# Altium schematic sheet S08.SchDoc: Quad Linear Amplifier
size 381 x 254 mm; Revision: 1.6; SheetNumber: 8; SheetTotal: 9
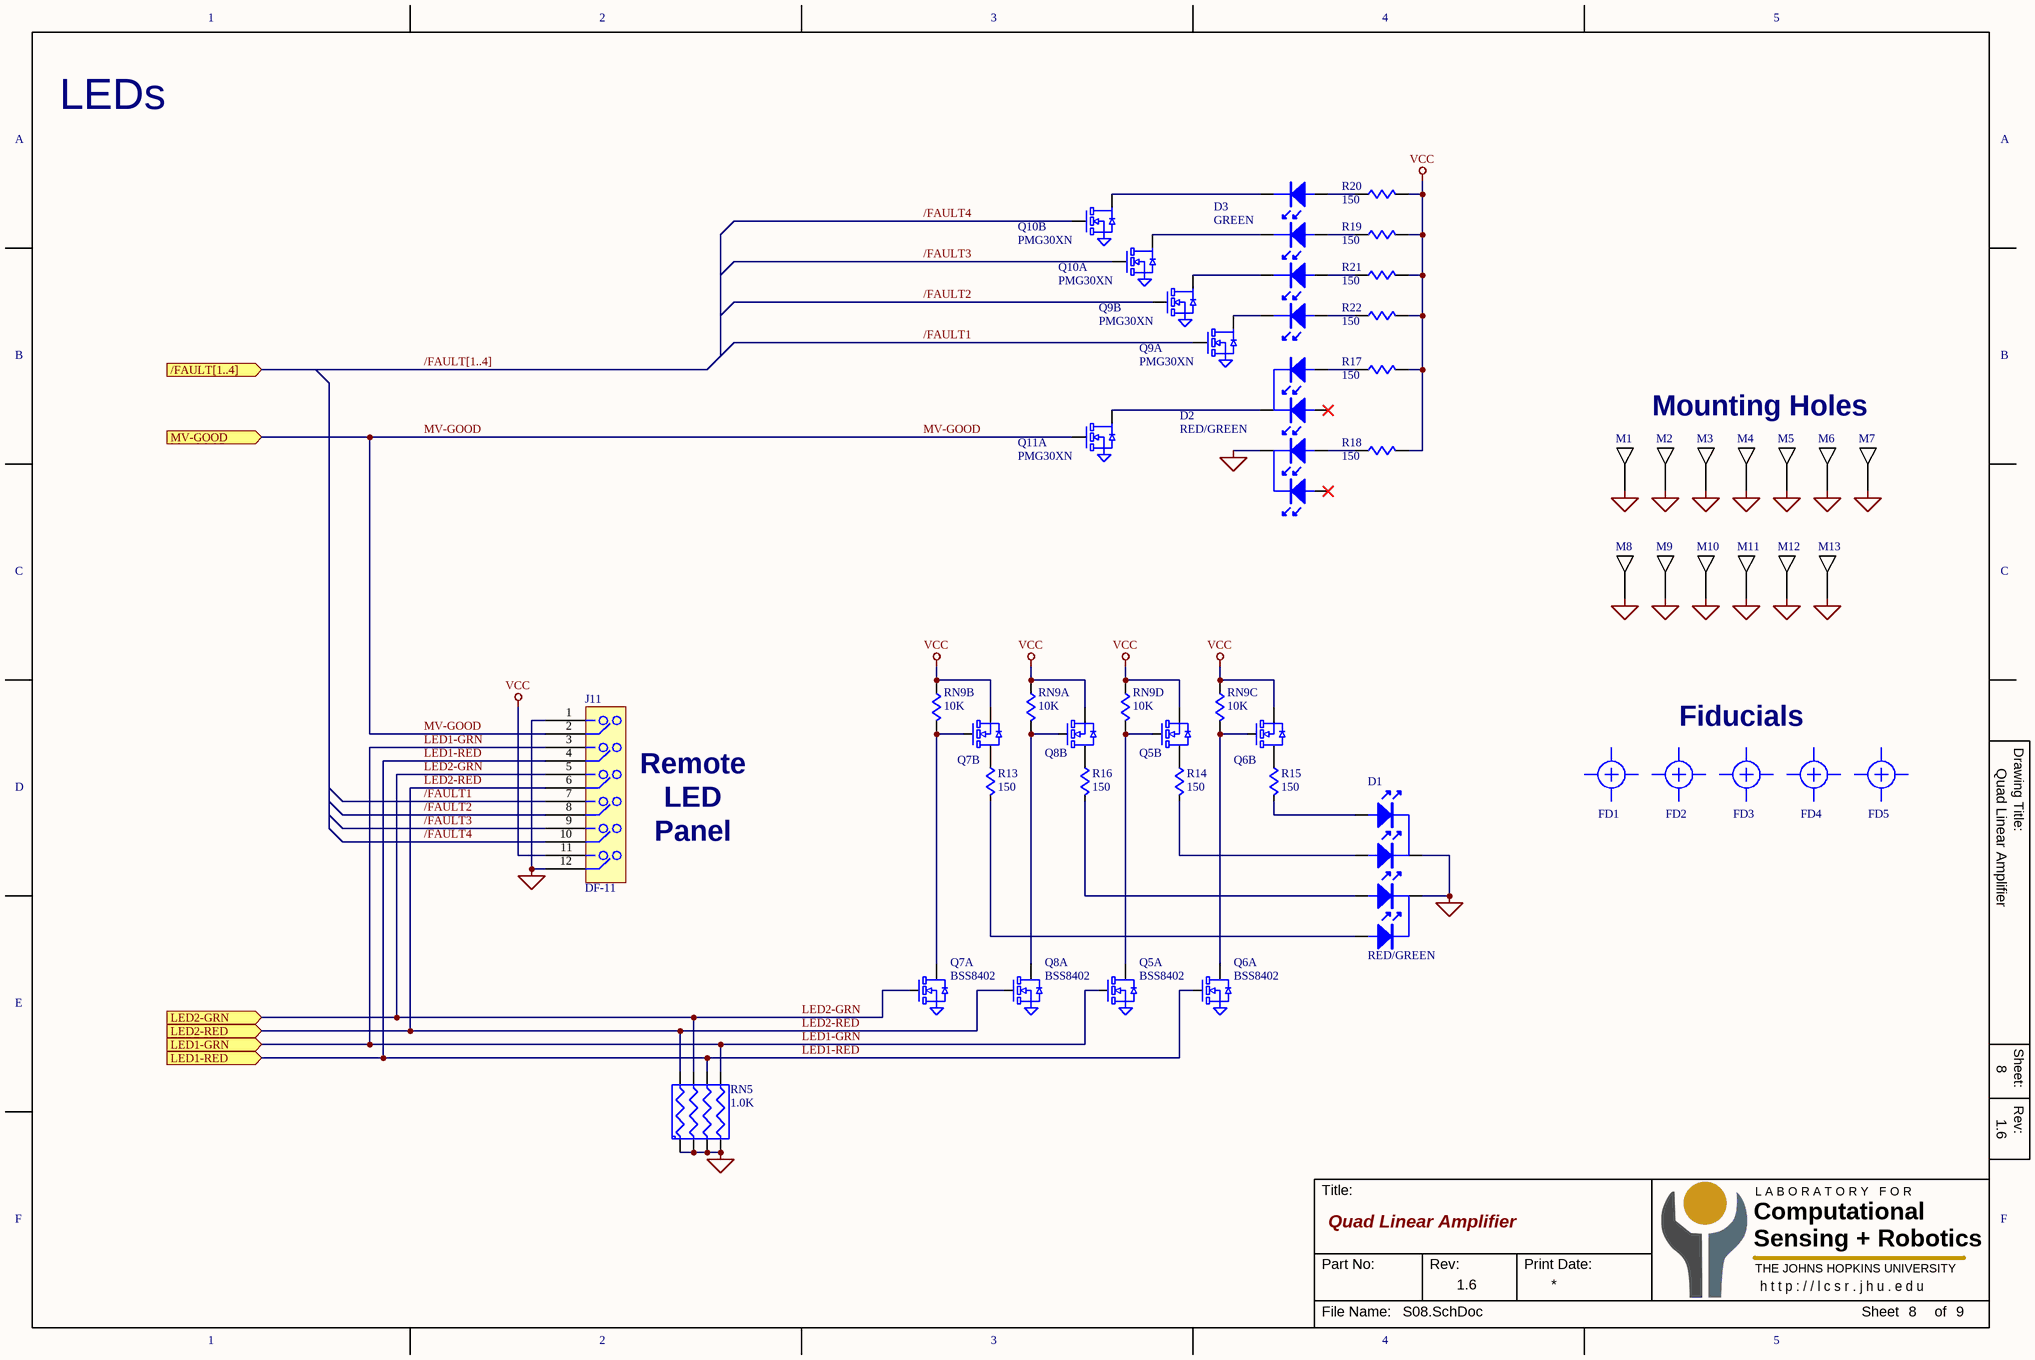
[diagram p0: S08.SchDoc]

## Parts
D1  RED/GREEN  [LED-3MM-2C-DUAL]
D2  RED/GREEN  [LED-3MM-2C-DUAL]
D3  GREEN  [LED-3MM-QUAD]
FD1  FD  [FD]  (value not drawn)  (no BOM)
FD2  FD  [FD]  (value not drawn)  (no BOM)
FD3  FD  [FD]  (value not drawn)  (no BOM)
FD4  FD  [FD]  (value not drawn)  (no BOM)
FD5  FD  [FD]  (value not drawn)  (no BOM)
J11  DF-11  [HDR-6x2-2MM]
M1  MHOLE  [MHOLE4]  (value not drawn)  (no BOM)
M2  MHOLE  [MHOLE4]  (value not drawn)  (no BOM)
M3  MHOLE  [MHOLE4]  (value not drawn)  (no BOM)
M4  MHOLE  [MHOLE4]  (value not drawn)  (no BOM)
M5  MHOLE  [MHOLE4]  (value not drawn)  (no BOM)
M6  MHOLE  [MHOLE4]  (value not drawn)  (no BOM)
M7  MHOLE  [MHOLE4]  (value not drawn)  (no BOM)
M8  MHOLE  [MHOLE4]  (value not drawn)  (no BOM)
M9  MHOLE  [MHOLE4]  (value not drawn)  (no BOM)
M10  MHOLE  [MHOLE4]  (value not drawn)  (no BOM)
M11  MHOLE  [MHOLE4]  (value not drawn)  (no BOM)
M12  MHOLE  [MHOLE4]  (value not drawn)  (no BOM)
M13  MHOLE  [MHOLE4]  (value not drawn)  (no BOM)
Q5  BSS8402  [SC70-6]  (parts A,B of 2)
Q6  BSS8402  [SC70-6]  (parts A,B of 2)
Q7  BSS8402  [SC70-6]  (parts A,B of 2)
Q8  BSS8402  [SC70-6]  (parts A,B of 2)
Q9  PMG30XN  [SC70-6]  (parts A,B of 2)
Q10  PMG30XN  [SC70-6]  (parts A,B of 2)
Q11  PMG30XN  [SC70-6]  (part A of 2)
R13  150  [R0603]
R14  150  [R0603]
R15  150  [R0603]
R16  150  [R0603]
R17  150  [R0603]
R18  150  [R0603]
R19  150  [R0603]
R20  150  [R0603]
R21  150  [R0603]
R22  150  [R0603]
RN5  1.0K  [RN-742C083]
RN9  10K  [RN-742C083]  (parts A,B,C,D of 4)

## Ports
/FAULT[1..4] (in), LED1-GRN (in), LED1-RED (in), LED2-GRN (in), LED2-RED (in), MV-GOOD (in)

## Nets
GND: D1.2(C) D1.5(C) D2.2(C) J11.1 J11.12 M1.1 M2.1 M3.1 M4.1 M5.1 M6.1 M7.1 M8.1 M9.1 M10.1 M11.1 M12.1 M13.1 Q5.1(S1) Q6.1(S1) Q7.1(S1) Q8.1(S1) Q9.1(S1) Q9.4(S2) Q10.1(S1) Q10.4(S2) Q11.1(S1) RN5.1(R1) RN5.2(R2.1) RN5.3(R3.1) RN5.4(R4.1)
VCC: J11.11 Q5.4(S2) Q6.4(S2) Q7.4(S2) Q8.4(S2) R17.2 R18.2 R19.2 R20.2 R21.2 R22.2 RN9.1 RN9.2 RN9.3 RN9.4
/FAULT1: J11.7 Q9.2(G1)
/FAULT2: J11.8 Q9.5(G2)
/FAULT3: J11.9 Q10.2(G1)
/FAULT4: J11.10 Q10.5(G2)
LED1-GRN: J11.3 Q5.2(G1) RN5.5(R4.2) ; port LED1-GRN
LED1-RED: J11.4 Q6.2(G1) RN5.6(R3.2) ; port LED1-RED
LED2-GRN: J11.5 Q7.2(G1) RN5.7(R2.2) ; port LED2-GRN
LED2-RED: J11.6 Q8.2(G1) RN5.8(R1.2) ; port LED2-RED
MV-GOOD: J11.2 Q11.2(G1) ; port MV-GOOD
NetD1_1: D1.1(A) R15.2
NetD1_3: D1.3(A) R14.2
NetD1_4: D1.4(A) R16.2
NetD1_6: D1.6(A) R13.2
NetD2_3: D2.3(A) R18.1
NetD2_5: D2.5(C) Q11.6(D1)
NetD2_6: D2.6(A) R17.1
NetD3_1: D3.1(C) Q9.6(D1)
NetD3_2: D3.2(A) R22.1
NetD3_3: D3.3(C) Q9.3(D2)
NetD3_4: D3.4(A) R21.1
NetD3_5: D3.5(C) Q10.6(D1)
NetD3_6: D3.6(A) R19.1
NetD3_7: D3.7(C) Q10.3(D2)
NetD3_8: D3.8(A) R20.1
NetQ5_3: Q5.3(D2) R14.1
NetQ5_5: Q5.5(G2) Q5.6(D1) RN9.5
NetQ6_3: Q6.3(D2) R15.1
NetQ6_5: Q6.5(G2) Q6.6(D1) RN9.6
NetQ7_3: Q7.3(D2) R13.1
NetQ7_5: Q7.5(G2) Q7.6(D1) RN9.7
NetQ8_3: Q8.3(D2) R16.1
NetQ8_5: Q8.5(G2) Q8.6(D1) RN9.8

Not connected (* = marked no-connect by the designer): D2 1(A)* 4(A)*

## Buses and harness runs
bus /FAULT[1..4] = port /FAULT[1..4]

## Notes on the sheet
- LEDs
- Mounting Holes
- Fiducials
- Panel
- Remote
- LED
- 1
- 2
- 3
- 4
- 5
- A
- B
- C
- Drawing Title:
- D
- E
- Sheet:
- Rev:
- F
- Title:
- Computational
- Sensing + Robotics
- L A B O R A T O R Y   F O R
- Part No:
- Print Date:
- THE JOHNS HOPKINS UNIVERSITY
- h t t p : / / l c s r . j h u . e d u
- File Name:
- Sheet
- of

## Library data of the parts
D1 D2 = LED-DUAL-2C
D3 = LED-QUAD
J11 = HEADER 6X2-1
M1-M13 = MHOLE: Mounting Hole
Q5-Q8 = MOSFET-N/P-6
Q9-Q11 = MOSFET-N-DUAL6
R13-R16 = R-MINI
R17-R22 = R
RN5 = RN-DISC-SM-4
RN9 = RN-DISC-SM-4X